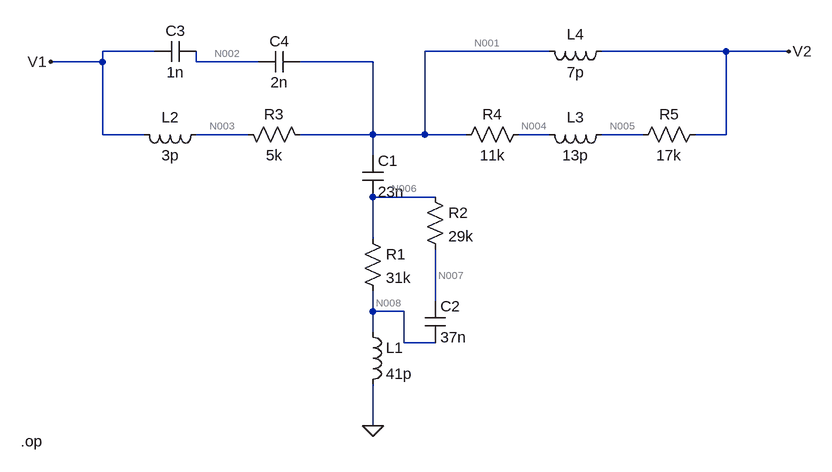
[diagram p0: schematic ejemplo 1.asc]
ejemplo 1.asc, the LTspice schematic file:
Version 4
SHEET 1 880 680
WIRE -432 -192 -512 -192
WIRE 176 -192 -16 -192
WIRE 448 -192 256 -192
WIRE 544 -192 448 -192
WIRE -512 -176 -512 -192
WIRE -512 -176 -592 -176
WIRE -368 -176 -368 -192
WIRE -272 -176 -368 -176
WIRE -96 -176 -208 -176
WIRE -512 -64 -512 -176
WIRE -448 -64 -512 -64
WIRE -288 -64 -368 -64
WIRE -96 -64 -96 -176
WIRE -96 -64 -208 -64
WIRE -16 -64 -16 -192
WIRE -16 -64 -96 -64
WIRE 48 -64 -16 -64
WIRE 176 -64 128 -64
WIRE 320 -64 256 -64
WIRE 448 -64 448 -192
WIRE 448 -64 400 -64
WIRE -96 -32 -96 -64
WIRE 0 32 -96 32
WIRE -96 96 -96 32
WIRE 0 192 0 112
WIRE -96 208 -96 176
WIRE -48 208 -96 208
WIRE -96 240 -96 208
WIRE -48 256 -48 208
WIRE 0 256 -48 256
WIRE -96 384 -96 320
FLAG -96 384 0
FLAG -592 -176 V1
FLAG 544 -192 V2
SYMBOL res -112 80 R0
SYMATTR InstName R1
SYMATTR Value 31k
SYMBOL res -16 16 R0
SYMATTR InstName R2
SYMATTR Value 29k
SYMBOL res -192 -48 M270
WINDOW 0 32 56 VTop 2
WINDOW 3 0 56 VBottom 2
SYMATTR InstName R3
SYMATTR Value 5k
SYMBOL res 144 -80 R90
WINDOW 0 0 56 VBottom 2
WINDOW 3 32 56 VTop 2
SYMATTR InstName R4
SYMATTR Value 11k
SYMBOL res 416 -80 R90
WINDOW 0 0 56 VBottom 2
WINDOW 3 32 56 VTop 2
SYMATTR InstName R5
SYMATTR Value 17k
SYMBOL cap -112 -32 R0
SYMATTR InstName C1
SYMATTR Value 23n
SYMBOL cap -16 192 R0
SYMATTR InstName C2
SYMATTR Value 37n
SYMBOL cap -368 -176 M270
WINDOW 0 32 32 VTop 2
WINDOW 3 0 32 VBottom 2
SYMATTR InstName C3
SYMATTR Value 1n
SYMBOL cap -208 -192 R90
WINDOW 0 0 32 VBottom 2
WINDOW 3 32 32 VTop 2
SYMATTR InstName C4
SYMATTR Value 2n
SYMBOL ind -112 224 R0
SYMATTR InstName L1
SYMATTR Value 41p
SYMBOL ind -352 -80 R90
WINDOW 0 5 56 VBottom 2
WINDOW 3 32 56 VTop 2
SYMATTR InstName L2
SYMATTR Value 3p
SYMBOL ind 272 -80 R90
WINDOW 0 5 56 VBottom 2
WINDOW 3 32 56 VTop 2
SYMATTR InstName L3
SYMATTR Value 13p
SYMBOL ind 272 -208 R90
WINDOW 0 5 56 VBottom 2
WINDOW 3 32 56 VTop 2
SYMATTR InstName L4
SYMATTR Value 7p
TEXT -638 408 Left 2 !.op

The netlist it stands for:
* ejemplo 1.asc
R1 N006 N008 31k
R2 N006 N007 29k
R3 N001 N003 5k
R4 N004 N001 11k
R5 V2 N005 17k
C1 N001 N006 23n
C2 N007 N008 37n
C3 N002 V1 1n
C4 N001 N002 2n
L1 N008 0 41p
L2 N003 V1 3p
L3 N005 N004 13p
L4 V2 N001 7p
.op
.backanno
.end

* Results of the author's LTspice run, read from the files saved beside the schematic
* Operating Point:
*   V(n006) = 0 V
*   V(n008) = 0 V
*   V(n007) = 0 V
*   V(n001) = 0 V
*   V(n003) = 0 V
*   V(n004) = 0 V
*   V(v2) = 0 V
*   V(n005) = 0 V
*   V(n002) = 0 V
*   V(v1) = 0 V
*   I(C4) = 0 A
*   I(C3) = 0 A
*   I(C2) = 0 A
*   I(C1) = 0 A
*   I(L4) = 0 A
*   I(L3) = 0 A
*   I(L2) = 0 A
*   I(L1) = 0 A
*   I(R5) = 0 A
*   I(R4) = 0 A
*   I(R3) = 0 A
*   I(R2) = 0 A
*   I(R1) = 0 A